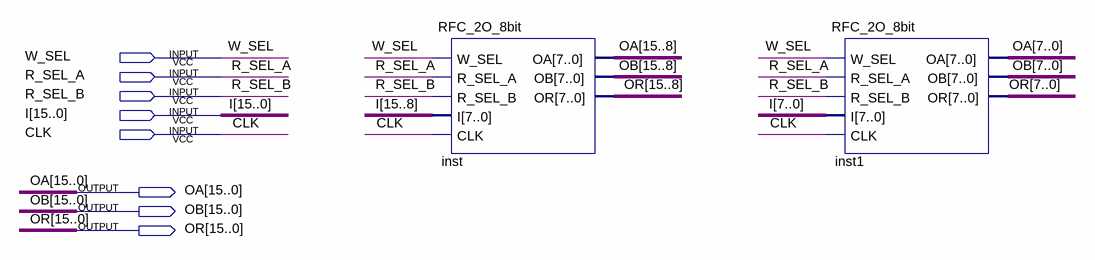
[diagram p0: schematic sheet]
// Quartus schematic RFC_2O_16bit.bdf as structural Verilog: 2 symbols, 8 pins
module RFC_2O_16bit (
  input  W_SEL,
  input  R_SEL_A,
  input  R_SEL_B,
  input  [15:0] I,
  input  CLK,
  output [15:0] OA,
  output [15:0] OB,
  output [15:0] OR
);

  RFC_2O_8bit inst (
    .W_SEL(W_SEL), .R_SEL_A(R_SEL_A), .R_SEL_B(R_SEL_B), .I(I[15:8]), .CLK(CLK), .OA(OA[15:8]),
    .OB(OB[15:8]), .OR(OR[15:8]));
  RFC_2O_8bit inst1 (
    .W_SEL(W_SEL), .R_SEL_A(R_SEL_A), .R_SEL_B(R_SEL_B), .I(I[7:0]), .CLK(CLK), .OA(OA[7:0]), .OB(OB[7:0]),
    .OR(OR[7:0]));
endmodule
